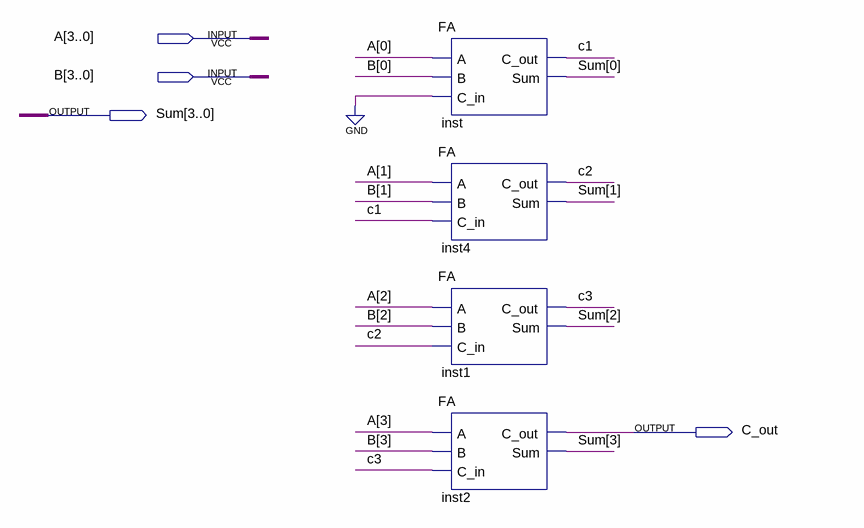
[diagram p0: schematic sheet]
// Quartus schematic 4Bit-FA.bdf as structural Verilog: 4 symbols, 4 pins
module \4Bit-FA  (
  input  [3:0] A,
  input  [3:0] B,
  output [3:0] Sum,
  output C_out
);

  wire c1, c2, c3;

  FA inst (.A(A[0]), .B(B[0]), .C_in(1'b0), .C_out(c1), .Sum(Sum[0]));
  FA inst4 (.A(A[1]), .B(B[1]), .C_in(c1), .C_out(c2), .Sum(Sum[1]));
  FA inst1 (.A(A[2]), .B(B[2]), .C_in(c2), .C_out(c3), .Sum(Sum[2]));
  FA inst2 (.A(A[3]), .B(B[3]), .C_in(c3), .C_out(C_out), .Sum(Sum[3]));
endmodule
